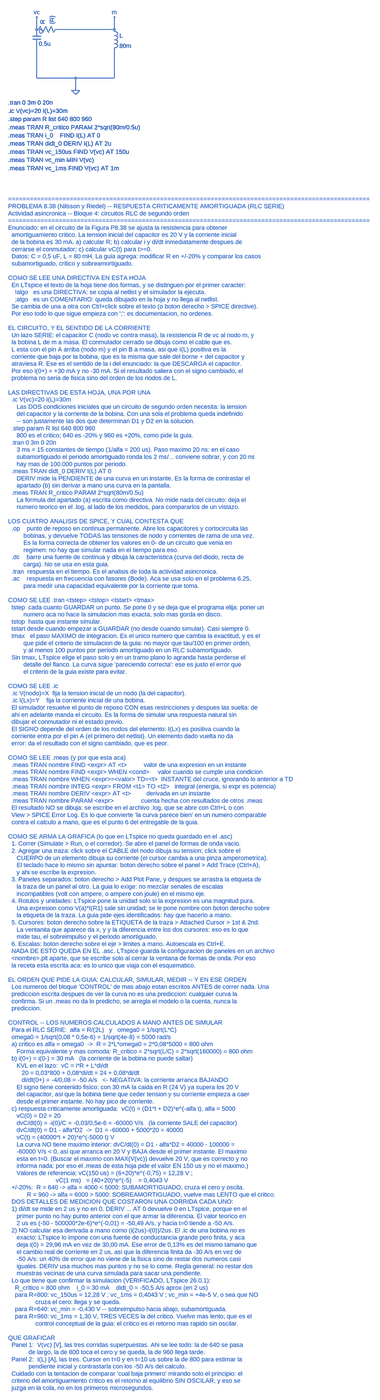
[diagram p0: schematic P8-38_RLC_serie_critico.asc, whole sheet]
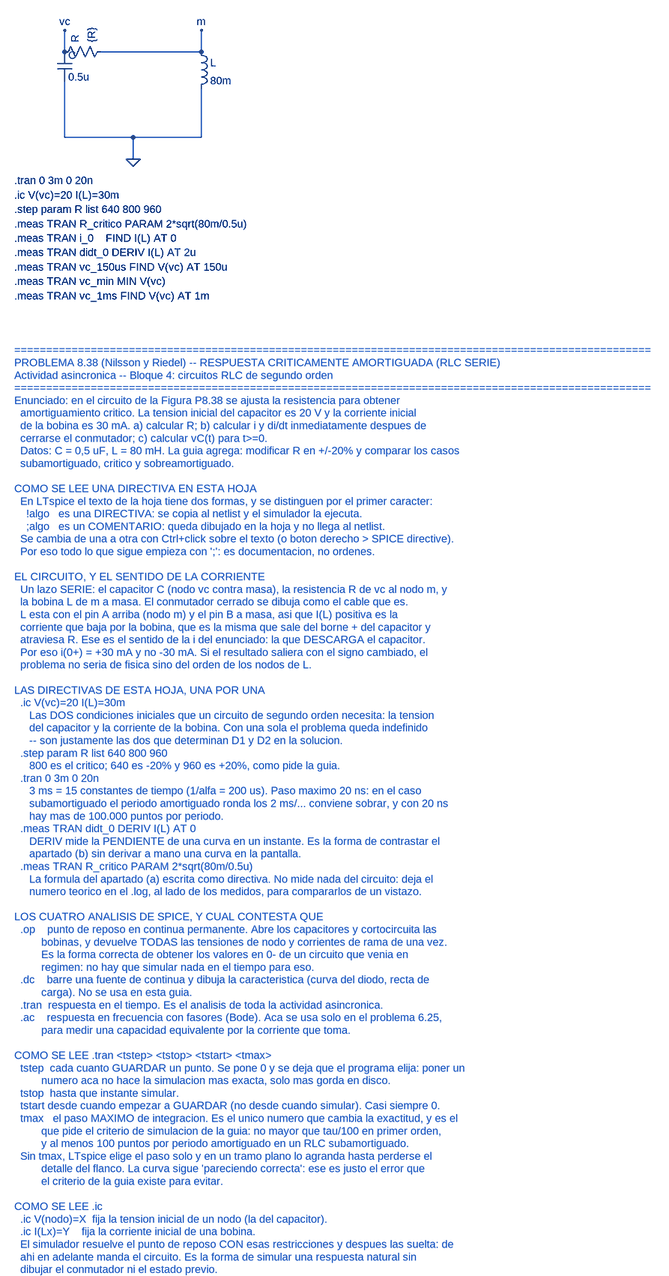
[diagram p1: schematic P8-38_RLC_serie_critico.asc, part, row 1 of 2, column 1 of 1]
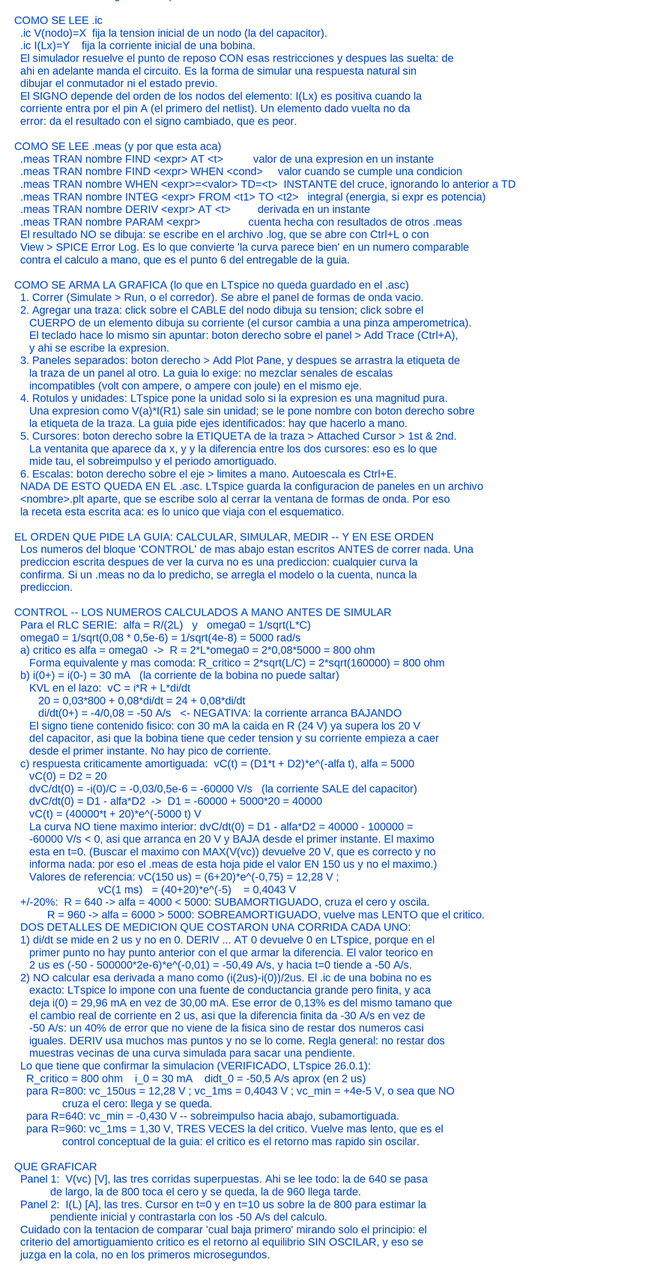
[diagram p2: schematic P8-38_RLC_serie_critico.asc, part, row 2 of 2, column 1 of 1]
P8-38_RLC_serie_critico.asc, the LTspice schematic file:
Version 4
SHEET 1 2200 2800
WIRE 176 176 176 304
WIRE 256 112 480 112
WIRE 480 192 480 304
WIRE 176 304 480 304
WIRE 328 304 328 352
WIRE 176 112 176 64
WIRE 480 112 480 64
FLAG 328 352 0
FLAG 176 64 vc
FLAG 480 64 m
SYMBOL cap 160 112 R0
SYMATTR InstName C
SYMATTR Value 0.5u
SYMBOL res 160 128 R270
SYMATTR InstName R
SYMATTR Value {R}
SYMBOL ind 464 96 R0
SYMATTR InstName L
SYMATTR Value 80m
SYMATTR Value2 Rser=0
TEXT 64 400 Left 2 !.tran 0 3m 0 20n
TEXT 64 432 Left 2 !.ic V(vc)=20 I(L)=30m
TEXT 64 464 Left 2 !.step param R list 640 800 960
TEXT 64 496 Left 2 !.meas TRAN R_critico PARAM 2*sqrt(80m/0.5u)
TEXT 64 528 Left 2 !.meas TRAN i_0    FIND I(L) AT 0
TEXT 64 560 Left 2 !.meas TRAN didt_0 DERIV I(L) AT 2u
TEXT 64 592 Left 2 !.meas TRAN vc_150us FIND V(vc) AT 150u
TEXT 64 624 Left 2 !.meas TRAN vc_min MIN V(vc)
TEXT 64 656 Left 2 !.meas TRAN vc_1ms FIND V(vc) AT 1m
TEXT 64 900 Left 2 ;====================================================================================================
TEXT 64 928 Left 2 ;PROBLEMA 8.38 (Nilsson y Riedel) -- RESPUESTA CRITICAMENTE AMORTIGUADA (RLC SERIE)
TEXT 64 956 Left 2 ;Actividad asincronica -- Bloque 4: circuitos RLC de segundo orden
TEXT 64 984 Left 2 ;====================================================================================================
TEXT 64 1012 Left 2 ;Enunciado: en el circuito de la Figura P8.38 se ajusta la resistencia para obtener
TEXT 64 1040 Left 2 ;  amortiguamiento critico. La tension inicial del capacitor es 20 V y la corriente inicial
TEXT 64 1068 Left 2 ;  de la bobina es 30 mA. a) calcular R; b) calcular i y di/dt inmediatamente despues de
TEXT 64 1096 Left 2 ;  cerrarse el conmutador; c) calcular vC(t) para t>=0.
TEXT 64 1124 Left 2 ;  Datos: C = 0,5 uF, L = 80 mH. La guia agrega: modificar R en +/-20% y comparar los casos
TEXT 64 1152 Left 2 ;  subamortiguado, critico y sobreamortiguado.
TEXT 64 1180 Left 2 ;
TEXT 64 1208 Left 2 ;COMO SE LEE UNA DIRECTIVA EN ESTA HOJA
TEXT 64 1236 Left 2 ;  En LTspice el texto de la hoja tiene dos formas, y se distinguen por el primer caracter:
TEXT 64 1264 Left 2 ;    !algo   es una DIRECTIVA: se copia al netlist y el simulador la ejecuta.
TEXT 64 1292 Left 2 ;    ;algo   es un COMENTARIO: queda dibujado en la hoja y no llega al netlist.
TEXT 64 1320 Left 2 ;  Se cambia de una a otra con Ctrl+click sobre el texto (o boton derecho > SPICE directive).
TEXT 64 1348 Left 2 ;  Por eso todo lo que sigue empieza con ';': es documentacion, no ordenes.
TEXT 64 1376 Left 2 ;
TEXT 64 1404 Left 2 ;EL CIRCUITO, Y EL SENTIDO DE LA CORRIENTE
TEXT 64 1432 Left 2 ;  Un lazo SERIE: el capacitor C (nodo vc contra masa), la resistencia R de vc al nodo m, y
TEXT 64 1460 Left 2 ;  la bobina L de m a masa. El conmutador cerrado se dibuja como el cable que es.
TEXT 64 1488 Left 2 ;  L esta con el pin A arriba (nodo m) y el pin B a masa, asi que I(L) positiva es la
TEXT 64 1516 Left 2 ;  corriente que baja por la bobina, que es la misma que sale del borne + del capacitor y
TEXT 64 1544 Left 2 ;  atraviesa R. Ese es el sentido de la i del enunciado: la que DESCARGA el capacitor.
TEXT 64 1572 Left 2 ;  Por eso i(0+) = +30 mA y no -30 mA. Si el resultado saliera con el signo cambiado, el
TEXT 64 1600 Left 2 ;  problema no seria de fisica sino del orden de los nodos de L.
TEXT 64 1628 Left 2 ;
TEXT 64 1656 Left 2 ;LAS DIRECTIVAS DE ESTA HOJA, UNA POR UNA
TEXT 64 1684 Left 2 ;  .ic V(vc)=20 I(L)=30m
TEXT 64 1712 Left 2 ;     Las DOS condiciones iniciales que un circuito de segundo orden necesita: la tension
TEXT 64 1740 Left 2 ;     del capacitor y la corriente de la bobina. Con una sola el problema queda indefinido
TEXT 64 1768 Left 2 ;     -- son justamente las dos que determinan D1 y D2 en la solucion.
TEXT 64 1796 Left 2 ;  .step param R list 640 800 960
TEXT 64 1824 Left 2 ;     800 es el critico; 640 es -20% y 960 es +20%, como pide la guia.
TEXT 64 1852 Left 2 ;  .tran 0 3m 0 20n
TEXT 64 1880 Left 2 ;     3 ms = 15 constantes de tiempo (1/alfa = 200 us). Paso maximo 20 ns: en el caso
TEXT 64 1908 Left 2 ;     subamortiguado el periodo amortiguado ronda los 2 ms/... conviene sobrar, y con 20 ns
TEXT 64 1936 Left 2 ;     hay mas de 100.000 puntos por periodo.
TEXT 64 1964 Left 2 ;  .meas TRAN didt_0 DERIV I(L) AT 0
TEXT 64 1992 Left 2 ;     DERIV mide la PENDIENTE de una curva en un instante. Es la forma de contrastar el
TEXT 64 2020 Left 2 ;     apartado (b) sin derivar a mano una curva en la pantalla.
TEXT 64 2048 Left 2 ;  .meas TRAN R_critico PARAM 2*sqrt(80m/0.5u)
TEXT 64 2076 Left 2 ;     La formula del apartado (a) escrita como directiva. No mide nada del circuito: deja el
TEXT 64 2104 Left 2 ;     numero teorico en el .log, al lado de los medidos, para compararlos de un vistazo.
TEXT 64 2132 Left 2 ;
TEXT 64 2160 Left 2 ;LOS CUATRO ANALISIS DE SPICE, Y CUAL CONTESTA QUE
TEXT 64 2188 Left 2 ;  .op    punto de reposo en continua permanente. Abre los capacitores y cortocircuita las
TEXT 64 2216 Left 2 ;         bobinas, y devuelve TODAS las tensiones de nodo y corrientes de rama de una vez.
TEXT 64 2244 Left 2 ;         Es la forma correcta de obtener los valores en 0- de un circuito que venia en
TEXT 64 2272 Left 2 ;         regimen: no hay que simular nada en el tiempo para eso.
TEXT 64 2300 Left 2 ;  .dc    barre una fuente de continua y dibuja la caracteristica (curva del diodo, recta de
TEXT 64 2328 Left 2 ;         carga). No se usa en esta guia.
TEXT 64 2356 Left 2 ;  .tran  respuesta en el tiempo. Es el analisis de toda la actividad asincronica.
TEXT 64 2384 Left 2 ;  .ac    respuesta en frecuencia con fasores (Bode). Aca se usa solo en el problema 6.25,
TEXT 64 2412 Left 2 ;         para medir una capacidad equivalente por la corriente que toma.
TEXT 64 2440 Left 2 ;
TEXT 64 2468 Left 2 ;COMO SE LEE .tran <tstep> <tstop> <tstart> <tmax>
TEXT 64 2496 Left 2 ;  tstep  cada cuanto GUARDAR un punto. Se pone 0 y se deja que el programa elija: poner un
TEXT 64 2524 Left 2 ;         numero aca no hace la simulacion mas exacta, solo mas gorda en disco.
TEXT 64 2552 Left 2 ;  tstop  hasta que instante simular.
TEXT 64 2580 Left 2 ;  tstart desde cuando empezar a GUARDAR (no desde cuando simular). Casi siempre 0.
TEXT 64 2608 Left 2 ;  tmax   el paso MAXIMO de integracion. Es el unico numero que cambia la exactitud, y es el
TEXT 64 2636 Left 2 ;         que pide el criterio de simulacion de la guia: no mayor que tau/100 en primer orden,
TEXT 64 2664 Left 2 ;         y al menos 100 puntos por periodo amortiguado en un RLC subamortiguado.
TEXT 64 2692 Left 2 ;  Sin tmax, LTspice elige el paso solo y en un tramo plano lo agranda hasta perderse el
TEXT 64 2720 Left 2 ;         detalle del flanco. La curva sigue 'pareciendo correcta': ese es justo el error que
TEXT 64 2748 Left 2 ;         el criterio de la guia existe para evitar.
TEXT 64 2776 Left 2 ;
TEXT 64 2804 Left 2 ;COMO SE LEE .ic
TEXT 64 2832 Left 2 ;  .ic V(nodo)=X  fija la tension inicial de un nodo (la del capacitor).
TEXT 64 2860 Left 2 ;  .ic I(Lx)=Y    fija la corriente inicial de una bobina.
TEXT 64 2888 Left 2 ;  El simulador resuelve el punto de reposo CON esas restricciones y despues las suelta: de
TEXT 64 2916 Left 2 ;  ahi en adelante manda el circuito. Es la forma de simular una respuesta natural sin
TEXT 64 2944 Left 2 ;  dibujar el conmutador ni el estado previo.
TEXT 64 2972 Left 2 ;  El SIGNO depende del orden de los nodos del elemento: I(Lx) es positiva cuando la
TEXT 64 3000 Left 2 ;  corriente entra por el pin A (el primero del netlist). Un elemento dado vuelta no da
TEXT 64 3028 Left 2 ;  error: da el resultado con el signo cambiado, que es peor.
TEXT 64 3056 Left 2 ;
TEXT 64 3084 Left 2 ;COMO SE LEE .meas (y por que esta aca)
TEXT 64 3112 Left 2 ;  .meas TRAN nombre FIND <expr> AT <t>          valor de una expresion en un instante
TEXT 64 3140 Left 2 ;  .meas TRAN nombre FIND <expr> WHEN <cond>     valor cuando se cumple una condicion
TEXT 64 3168 Left 2 ;  .meas TRAN nombre WHEN <expr>=<valor> TD=<t>  INSTANTE del cruce, ignorando lo anterior a TD
TEXT 64 3196 Left 2 ;  .meas TRAN nombre INTEG <expr> FROM <t1> TO <t2>   integral (energia, si expr es potencia)
TEXT 64 3224 Left 2 ;  .meas TRAN nombre DERIV <expr> AT <t>         derivada en un instante
TEXT 64 3252 Left 2 ;  .meas TRAN nombre PARAM <expr>                cuenta hecha con resultados de otros .meas
TEXT 64 3280 Left 2 ;  El resultado NO se dibuja: se escribe en el archivo .log, que se abre con Ctrl+L o con
TEXT 64 3308 Left 2 ;  View > SPICE Error Log. Es lo que convierte 'la curva parece bien' en un numero comparable
TEXT 64 3336 Left 2 ;  contra el calculo a mano, que es el punto 6 del entregable de la guia.
TEXT 64 3364 Left 2 ;
TEXT 64 3392 Left 2 ;COMO SE ARMA LA GRAFICA (lo que en LTspice no queda guardado en el .asc)
TEXT 64 3420 Left 2 ;  1. Correr (Simulate > Run, o el corredor). Se abre el panel de formas de onda vacio.
TEXT 64 3448 Left 2 ;  2. Agregar una traza: click sobre el CABLE del nodo dibuja su tension; click sobre el
TEXT 64 3476 Left 2 ;     CUERPO de un elemento dibuja su corriente (el cursor cambia a una pinza amperometrica).
TEXT 64 3504 Left 2 ;     El teclado hace lo mismo sin apuntar: boton derecho sobre el panel > Add Trace (Ctrl+A),
TEXT 64 3532 Left 2 ;     y ahi se escribe la expresion.
TEXT 64 3560 Left 2 ;  3. Paneles separados: boton derecho > Add Plot Pane, y despues se arrastra la etiqueta de
TEXT 64 3588 Left 2 ;     la traza de un panel al otro. La guia lo exige: no mezclar senales de escalas
TEXT 64 3616 Left 2 ;     incompatibles (volt con ampere, o ampere con joule) en el mismo eje.
TEXT 64 3644 Left 2 ;  4. Rotulos y unidades: LTspice pone la unidad solo si la expresion es una magnitud pura.
TEXT 64 3672 Left 2 ;     Una expresion como V(a)*I(R1) sale sin unidad; se le pone nombre con boton derecho sobre
TEXT 64 3700 Left 2 ;     la etiqueta de la traza. La guia pide ejes identificados: hay que hacerlo a mano.
TEXT 64 3728 Left 2 ;  5. Cursores: boton derecho sobre la ETIQUETA de la traza > Attached Cursor > 1st & 2nd.
TEXT 64 3756 Left 2 ;     La ventanita que aparece da x, y y la diferencia entre los dos cursores: eso es lo que
TEXT 64 3784 Left 2 ;     mide tau, el sobreimpulso y el periodo amortiguado.
TEXT 64 3812 Left 2 ;  6. Escalas: boton derecho sobre el eje > limites a mano. Autoescala es Ctrl+E.
TEXT 64 3840 Left 2 ;  NADA DE ESTO QUEDA EN EL .asc. LTspice guarda la configuracion de paneles en un archivo
TEXT 64 3868 Left 2 ;  <nombre>.plt aparte, que se escribe solo al cerrar la ventana de formas de onda. Por eso
TEXT 64 3896 Left 2 ;  la receta esta escrita aca: es lo unico que viaja con el esquematico.
TEXT 64 3924 Left 2 ;
TEXT 64 3952 Left 2 ;EL ORDEN QUE PIDE LA GUIA: CALCULAR, SIMULAR, MEDIR -- Y EN ESE ORDEN
TEXT 64 3980 Left 2 ;  Los numeros del bloque 'CONTROL' de mas abajo estan escritos ANTES de correr nada. Una
TEXT 64 4008 Left 2 ;  prediccion escrita despues de ver la curva no es una prediccion: cualquier curva la
TEXT 64 4036 Left 2 ;  confirma. Si un .meas no da lo predicho, se arregla el modelo o la cuenta, nunca la
TEXT 64 4064 Left 2 ;  prediccion.
TEXT 64 4092 Left 2 ;
TEXT 64 4120 Left 2 ;CONTROL -- LOS NUMEROS CALCULADOS A MANO ANTES DE SIMULAR
TEXT 64 4148 Left 2 ;  Para el RLC SERIE:  alfa = R/(2L)   y   omega0 = 1/sqrt(L*C)
TEXT 64 4176 Left 2 ;  omega0 = 1/sqrt(0,08 * 0,5e-6) = 1/sqrt(4e-8) = 5000 rad/s
TEXT 64 4204 Left 2 ;  a) critico es alfa = omega0  ->  R = 2*L*omega0 = 2*0,08*5000 = 800 ohm
TEXT 64 4232 Left 2 ;     Forma equivalente y mas comoda: R_critico = 2*sqrt(L/C) = 2*sqrt(160000) = 800 ohm
TEXT 64 4260 Left 2 ;  b) i(0+) = i(0-) = 30 mA   (la corriente de la bobina no puede saltar)
TEXT 64 4288 Left 2 ;     KVL en el lazo:  vC = i*R + L*di/dt
TEXT 64 4316 Left 2 ;        20 = 0,03*800 + 0,08*di/dt = 24 + 0,08*di/dt
TEXT 64 4344 Left 2 ;        di/dt(0+) = -4/0,08 = -50 A/s   <- NEGATIVA: la corriente arranca BAJANDO
TEXT 64 4372 Left 2 ;     El signo tiene contenido fisico: con 30 mA la caida en R (24 V) ya supera los 20 V
TEXT 64 4400 Left 2 ;     del capacitor, asi que la bobina tiene que ceder tension y su corriente empieza a caer
TEXT 64 4428 Left 2 ;     desde el primer instante. No hay pico de corriente.
TEXT 64 4456 Left 2 ;  c) respuesta criticamente amortiguada:  vC(t) = (D1*t + D2)*e^(-alfa t), alfa = 5000
TEXT 64 4484 Left 2 ;     vC(0) = D2 = 20
TEXT 64 4512 Left 2 ;     dvC/dt(0) = -i(0)/C = -0,03/0,5e-6 = -60000 V/s   (la corriente SALE del capacitor)
TEXT 64 4540 Left 2 ;     dvC/dt(0) = D1 - alfa*D2  ->  D1 = -60000 + 5000*20 = 40000
TEXT 64 4568 Left 2 ;     vC(t) = (40000*t + 20)*e^(-5000 t) V
TEXT 64 4596 Left 2 ;     La curva NO tiene maximo interior: dvC/dt(0) = D1 - alfa*D2 = 40000 - 100000 =
TEXT 64 4624 Left 2 ;     -60000 V/s < 0, asi que arranca en 20 V y BAJA desde el primer instante. El maximo
TEXT 64 4652 Left 2 ;     esta en t=0. (Buscar el maximo con MAX(V(vc)) devuelve 20 V, que es correcto y no
TEXT 64 4680 Left 2 ;     informa nada: por eso el .meas de esta hoja pide el valor EN 150 us y no el maximo.)
TEXT 64 4708 Left 2 ;     Valores de referencia: vC(150 us) = (6+20)*e^(-0,75) = 12,28 V ;
TEXT 64 4736 Left 2 ;                            vC(1 ms)   = (40+20)*e^(-5)    = 0,4043 V
TEXT 64 4764 Left 2 ;  +/-20%:  R = 640 -> alfa = 4000 < 5000: SUBAMORTIGUADO, cruza el cero y oscila.
TEXT 64 4792 Left 2 ;           R = 960 -> alfa = 6000 > 5000: SOBREAMORTIGUADO, vuelve mas LENTO que el critico.
TEXT 64 4820 Left 2 ;  DOS DETALLES DE MEDICION QUE COSTARON UNA CORRIDA CADA UNO:
TEXT 64 4848 Left 2 ;  1) di/dt se mide en 2 us y no en 0. DERIV ... AT 0 devuelve 0 en LTspice, porque en el
TEXT 64 4876 Left 2 ;     primer punto no hay punto anterior con el que armar la diferencia. El valor teorico en
TEXT 64 4904 Left 2 ;     2 us es (-50 - 500000*2e-6)*e^(-0,01) = -50,49 A/s, y hacia t=0 tiende a -50 A/s.
TEXT 64 4932 Left 2 ;  2) NO calcular esa derivada a mano como (i(2us)-i(0))/2us. El .ic de una bobina no es
TEXT 64 4960 Left 2 ;     exacto: LTspice lo impone con una fuente de conductancia grande pero finita, y aca
TEXT 64 4988 Left 2 ;     deja i(0) = 29,96 mA en vez de 30,00 mA. Ese error de 0,13% es del mismo tamano que
TEXT 64 5016 Left 2 ;     el cambio real de corriente en 2 us, asi que la diferencia finita da -30 A/s en vez de
TEXT 64 5044 Left 2 ;     -50 A/s: un 40% de error que no viene de la fisica sino de restar dos numeros casi
TEXT 64 5072 Left 2 ;     iguales. DERIV usa muchos mas puntos y no se lo come. Regla general: no restar dos
TEXT 64 5100 Left 2 ;     muestras vecinas de una curva simulada para sacar una pendiente.
TEXT 64 5128 Left 2 ;  Lo que tiene que confirmar la simulacion (VERIFICADO, LTspice 26.0.1):
TEXT 64 5156 Left 2 ;    R_critico = 800 ohm    i_0 = 30 mA    didt_0 = -50,5 A/s aprox (en 2 us)
TEXT 64 5184 Left 2 ;    para R=800: vc_150us = 12,28 V ; vc_1ms = 0,4043 V ; vc_min = +4e-5 V, o sea que NO
TEXT 64 5212 Left 2 ;                cruza el cero: llega y se queda.
TEXT 64 5240 Left 2 ;    para R=640: vc_min = -0,430 V -- sobreimpulso hacia abajo, subamortiguada.
TEXT 64 5268 Left 2 ;    para R=960: vc_1ms = 1,30 V, TRES VECES la del critico. Vuelve mas lento, que es el
TEXT 64 5296 Left 2 ;                control conceptual de la guia: el critico es el retorno mas rapido sin oscilar.
TEXT 64 5324 Left 2 ;
TEXT 64 5352 Left 2 ;QUE GRAFICAR
TEXT 64 5380 Left 2 ;  Panel 1:  V(vc) [V], las tres corridas superpuestas. Ahi se lee todo: la de 640 se pasa
TEXT 64 5408 Left 2 ;            de largo, la de 800 toca el cero y se queda, la de 960 llega tarde.
TEXT 64 5436 Left 2 ;  Panel 2:  I(L) [A], las tres. Cursor en t=0 y en t=10 us sobre la de 800 para estimar la
TEXT 64 5464 Left 2 ;            pendiente inicial y contrastarla con los -50 A/s del calculo.
TEXT 64 5492 Left 2 ;  Cuidado con la tentacion de comparar 'cual baja primero' mirando solo el principio: el
TEXT 64 5520 Left 2 ;  criterio del amortiguamiento critico es el retorno al equilibrio SIN OSCILAR, y eso se
TEXT 64 5548 Left 2 ;  juzga en la cola, no en los primeros microsegundos.

The netlist it stands for:
* P8-38_RLC_serie_critico.asc
C vc 0 0.5u
R vc m {R}
L m 0 80m Rser=0
.tran 0 3m 0 20n
.ic V(vc)=20 I(L)=30m
.step param R list 640 800 960
.meas TRAN R_critico PARAM 2*sqrt(80m/0.5u)
.meas TRAN i_0    FIND I(L) AT 0
.meas TRAN didt_0 DERIV I(L) AT 2u
.meas TRAN vc_150us FIND V(vc) AT 150u
.meas TRAN vc_min MIN V(vc)
.meas TRAN vc_1ms FIND V(vc) AT 1m
* ====================================================================================================
* PROBLEMA 8.38 (Nilsson y Riedel) -- RESPUESTA CRITICAMENTE AMORTIGUADA (RLC SERIE)
* Actividad asincronica -- Bloque 4: circuitos RLC de segundo orden
* ====================================================================================================
* Enunciado: en el circuito de la Figura P8.38 se ajusta la resistencia para obtener
*   amortiguamiento critico. La tension inicial del capacitor es 20 V y la corriente inicial
*   de la bobina es 30 mA. a) calcular R; b) calcular i y di/dt inmediatamente despues de
*   cerrarse el conmutador; c) calcular vC(t) para t>=0.
*   Datos: C = 0,5 uF, L = 80 mH. La guia agrega: modificar R en +/-20% y comparar los casos
*   subamortiguado, critico y sobreamortiguado.
* COMO SE LEE UNA DIRECTIVA EN ESTA HOJA
*   En LTspice el texto de la hoja tiene dos formas, y se distinguen por el primer caracter:
*     !algo   es una DIRECTIVA: se copia al netlist y el simulador la ejecuta.
*     ;algo   es un COMENTARIO: queda dibujado en la hoja y no llega al netlist.
*   Se cambia de una a otra con Ctrl+click sobre el texto (o boton derecho > SPICE directive).
*   Por eso todo lo que sigue empieza con ';': es documentacion, no ordenes.
* EL CIRCUITO, Y EL SENTIDO DE LA CORRIENTE
*   Un lazo SERIE: el capacitor C (nodo vc contra masa), la resistencia R de vc al nodo m, y
*   la bobina L de m a masa. El conmutador cerrado se dibuja como el cable que es.
*   L esta con el pin A arriba (nodo m) y el pin B a masa, asi que I(L) positiva es la
*   corriente que baja por la bobina, que es la misma que sale del borne + del capacitor y
*   atraviesa R. Ese es el sentido de la i del enunciado: la que DESCARGA el capacitor.
*   Por eso i(0+) = +30 mA y no -30 mA. Si el resultado saliera con el signo cambiado, el
*   problema no seria de fisica sino del orden de los nodos de L.
* LAS DIRECTIVAS DE ESTA HOJA, UNA POR UNA
*   .ic V(vc)=20 I(L)=30m
*      Las DOS condiciones iniciales que un circuito de segundo orden necesita: la tension
*      del capacitor y la corriente de la bobina. Con una sola el problema queda indefinido
*      -- son justamente las dos que determinan D1 y D2 en la solucion.
*   .step param R list 640 800 960
*      800 es el critico; 640 es -20% y 960 es +20%, como pide la guia.
*   .tran 0 3m 0 20n
*      3 ms = 15 constantes de tiempo (1/alfa = 200 us). Paso maximo 20 ns: en el caso
*      subamortiguado el periodo amortiguado ronda los 2 ms/... conviene sobrar, y con 20 ns
*      hay mas de 100.000 puntos por periodo.
*   .meas TRAN didt_0 DERIV I(L) AT 0
*      DERIV mide la PENDIENTE de una curva en un instante. Es la forma de contrastar el
*      apartado (b) sin derivar a mano una curva en la pantalla.
*   .meas TRAN R_critico PARAM 2*sqrt(80m/0.5u)
*      La formula del apartado (a) escrita como directiva. No mide nada del circuito: deja el
*      numero teorico en el .log, al lado de los medidos, para compararlos de un vistazo.
* LOS CUATRO ANALISIS DE SPICE, Y CUAL CONTESTA QUE
*   .op    punto de reposo en continua permanente. Abre los capacitores y cortocircuita las
*          bobinas, y devuelve TODAS las tensiones de nodo y corrientes de rama de una vez.
*          Es la forma correcta de obtener los valores en 0- de un circuito que venia en
*          regimen: no hay que simular nada en el tiempo para eso.
*   .dc    barre una fuente de continua y dibuja la caracteristica (curva del diodo, recta de
*          carga). No se usa en esta guia.
*   .tran  respuesta en el tiempo. Es el analisis de toda la actividad asincronica.
*   .ac    respuesta en frecuencia con fasores (Bode). Aca se usa solo en el problema 6.25,
*          para medir una capacidad equivalente por la corriente que toma.
* COMO SE LEE .tran <tstep> <tstop> <tstart> <tmax>
*   tstep  cada cuanto GUARDAR un punto. Se pone 0 y se deja que el programa elija: poner un
*          numero aca no hace la simulacion mas exacta, solo mas gorda en disco.
*   tstop  hasta que instante simular.
*   tstart desde cuando empezar a GUARDAR (no desde cuando simular). Casi siempre 0.
*   tmax   el paso MAXIMO de integracion. Es el unico numero que cambia la exactitud, y es el
*          que pide el criterio de simulacion de la guia: no mayor que tau/100 en primer orden,
*          y al menos 100 puntos por periodo amortiguado en un RLC subamortiguado.
*   Sin tmax, LTspice elige el paso solo y en un tramo plano lo agranda hasta perderse el
*          detalle del flanco. La curva sigue 'pareciendo correcta': ese es justo el error que
*          el criterio de la guia existe para evitar.
* COMO SE LEE .ic
*   .ic V(nodo)=X  fija la tension inicial de un nodo (la del capacitor).
*   .ic I(Lx)=Y    fija la corriente inicial de una bobina.
*   El simulador resuelve el punto de reposo CON esas restricciones y despues las suelta: de
*   ahi en adelante manda el circuito. Es la forma de simular una respuesta natural sin
*   dibujar el conmutador ni el estado previo.
*   El SIGNO depende del orden de los nodos del elemento: I(Lx) es positiva cuando la
*   corriente entra por el pin A (el primero del netlist). Un elemento dado vuelta no da
*   error: da el resultado con el signo cambiado, que es peor.
* COMO SE LEE .meas (y por que esta aca)
*   .meas TRAN nombre FIND <expr> AT <t>          valor de una expresion en un instante
*   .meas TRAN nombre FIND <expr> WHEN <cond>     valor cuando se cumple una condicion
*   .meas TRAN nombre WHEN <expr>=<valor> TD=<t>  INSTANTE del cruce, ignorando lo anterior a TD
*   .meas TRAN nombre INTEG <expr> FROM <t1> TO <t2>   integral (energia, si expr es potencia)
*   .meas TRAN nombre DERIV <expr> AT <t>         derivada en un instante
*   .meas TRAN nombre PARAM <expr>                cuenta hecha con resultados de otros .meas
*   El resultado NO se dibuja: se escribe en el archivo .log, que se abre con Ctrl+L o con
*   View > SPICE Error Log. Es lo que convierte 'la curva parece bien' en un numero comparable
*   contra el calculo a mano, que es el punto 6 del entregable de la guia.
* COMO SE ARMA LA GRAFICA (lo que en LTspice no queda guardado en el .asc)
*   1. Correr (Simulate > Run, o el corredor). Se abre el panel de formas de onda vacio.
*   2. Agregar una traza: click sobre el CABLE del nodo dibuja su tension; click sobre el
*      CUERPO de un elemento dibuja su corriente (el cursor cambia a una pinza amperometrica).
*      El teclado hace lo mismo sin apuntar: boton derecho sobre el panel > Add Trace (Ctrl+A),
*      y ahi se escribe la expresion.
*   3. Paneles separados: boton derecho > Add Plot Pane, y despues se arrastra la etiqueta de
*      la traza de un panel al otro. La guia lo exige: no mezclar senales de escalas
*      incompatibles (volt con ampere, o ampere con joule) en el mismo eje.
*   4. Rotulos y unidades: LTspice pone la unidad solo si la expresion es una magnitud pura.
*      Una expresion como V(a)*I(R1) sale sin unidad; se le pone nombre con boton derecho sobre
*      la etiqueta de la traza. La guia pide ejes identificados: hay que hacerlo a mano.
*   5. Cursores: boton derecho sobre la ETIQUETA de la traza > Attached Cursor > 1st & 2nd.
*      La ventanita que aparece da x, y y la diferencia entre los dos cursores: eso es lo que
*      mide tau, el sobreimpulso y el periodo amortiguado.
*   6. Escalas: boton derecho sobre el eje > limites a mano. Autoescala es Ctrl+E.
*   NADA DE ESTO QUEDA EN EL .asc. LTspice guarda la configuracion de paneles en un archivo
*   <nombre>.plt aparte, que se escribe solo al cerrar la ventana de formas de onda. Por eso
*   la receta esta escrita aca: es lo unico que viaja con el esquematico.
* EL ORDEN QUE PIDE LA GUIA: CALCULAR, SIMULAR, MEDIR -- Y EN ESE ORDEN
*   Los numeros del bloque 'CONTROL' de mas abajo estan escritos ANTES de correr nada. Una
*   prediccion escrita despues de ver la curva no es una prediccion: cualquier curva la
*   confirma. Si un .meas no da lo predicho, se arregla el modelo o la cuenta, nunca la
*   prediccion.
* CONTROL -- LOS NUMEROS CALCULADOS A MANO ANTES DE SIMULAR
*   Para el RLC SERIE:  alfa = R/(2L)   y   omega0 = 1/sqrt(L*C)
*   omega0 = 1/sqrt(0,08 * 0,5e-6) = 1/sqrt(4e-8) = 5000 rad/s
*   a) critico es alfa = omega0  ->  R = 2*L*omega0 = 2*0,08*5000 = 800 ohm
*      Forma equivalente y mas comoda: R_critico = 2*sqrt(L/C) = 2*sqrt(160000) = 800 ohm
*   b) i(0+) = i(0-) = 30 mA   (la corriente de la bobina no puede saltar)
*      KVL en el lazo:  vC = i*R + L*di/dt
*         20 = 0,03*800 + 0,08*di/dt = 24 + 0,08*di/dt
*         di/dt(0+) = -4/0,08 = -50 A/s   <- NEGATIVA: la corriente arranca BAJANDO
*      El signo tiene contenido fisico: con 30 mA la caida en R (24 V) ya supera los 20 V
*      del capacitor, asi que la bobina tiene que ceder tension y su corriente empieza a caer
*      desde el primer instante. No hay pico de corriente.
*   c) respuesta criticamente amortiguada:  vC(t) = (D1*t + D2)*e^(-alfa t), alfa = 5000
*      vC(0) = D2 = 20
*      dvC/dt(0) = -i(0)/C = -0,03/0,5e-6 = -60000 V/s   (la corriente SALE del capacitor)
*      dvC/dt(0) = D1 - alfa*D2  ->  D1 = -60000 + 5000*20 = 40000
*      vC(t) = (40000*t + 20)*e^(-5000 t) V
*      La curva NO tiene maximo interior: dvC/dt(0) = D1 - alfa*D2 = 40000 - 100000 =
*      -60000 V/s < 0, asi que arranca en 20 V y BAJA desde el primer instante. El maximo
*      esta en t=0. (Buscar el maximo con MAX(V(vc)) devuelve 20 V, que es correcto y no
*      informa nada: por eso el .meas de esta hoja pide el valor EN 150 us y no el maximo.)
*      Valores de referencia: vC(150 us) = (6+20)*e^(-0,75) = 12,28 V ;
*                             vC(1 ms)   = (40+20)*e^(-5)    = 0,4043 V
*   +/-20%:  R = 640 -> alfa = 4000 < 5000: SUBAMORTIGUADO, cruza el cero y oscila.
*            R = 960 -> alfa = 6000 > 5000: SOBREAMORTIGUADO, vuelve mas LENTO que el critico.
*   DOS DETALLES DE MEDICION QUE COSTARON UNA CORRIDA CADA UNO:
*   1) di/dt se mide en 2 us y no en 0. DERIV ... AT 0 devuelve 0 en LTspice, porque en el
*      primer punto no hay punto anterior con el que armar la diferencia. El valor teorico en
*      2 us es (-50 - 500000*2e-6)*e^(-0,01) = -50,49 A/s, y hacia t=0 tiende a -50 A/s.
*   2) NO calcular esa derivada a mano como (i(2us)-i(0))/2us. El .ic de una bobina no es
*      exacto: LTspice lo impone con una fuente de conductancia grande pero finita, y aca
*      deja i(0) = 29,96 mA en vez de 30,00 mA. Ese error de 0,13% es del mismo tamano que
*      el cambio real de corriente en 2 us, asi que la diferencia finita da -30 A/s en vez de
*      -50 A/s: un 40% de error que no viene de la fisica sino de restar dos numeros casi
*      iguales. DERIV usa muchos mas puntos y no se lo come. Regla general: no restar dos
*      muestras vecinas de una curva simulada para sacar una pendiente.
*   Lo que tiene que confirmar la simulacion (VERIFICADO, LTspice 26.0.1):
*     R_critico = 800 ohm    i_0 = 30 mA    didt_0 = -50,5 A/s aprox (en 2 us)
*     para R=800: vc_150us = 12,28 V ; vc_1ms = 0,4043 V ; vc_min = +4e-5 V, o sea que NO
*                 cruza el cero: llega y se queda.
*     para R=640: vc_min = -0,430 V -- sobreimpulso hacia abajo, subamortiguada.
*     para R=960: vc_1ms = 1,30 V, TRES VECES la del critico. Vuelve mas lento, que es el
*                 control conceptual de la guia: el critico es el retorno mas rapido sin oscilar.
* QUE GRAFICAR
*   Panel 1:  V(vc) [V], las tres corridas superpuestas. Ahi se lee todo: la de 640 se pasa
*             de largo, la de 800 toca el cero y se queda, la de 960 llega tarde.
*   Panel 2:  I(L) [A], las tres. Cursor en t=0 y en t=10 us sobre la de 800 para estimar la
*             pendiente inicial y contrastarla con los -50 A/s del calculo.
*   Cuidado con la tentacion de comparar 'cual baja primero' mirando solo el principio: el
*   criterio del amortiguamiento critico es el retorno al equilibrio SIN OSCILAR, y eso se
*   juzga en la cola, no en los primeros microsegundos.
.backanno
.end